# EAGLE schematic PCB_Design (EAGLE 8.6.0)
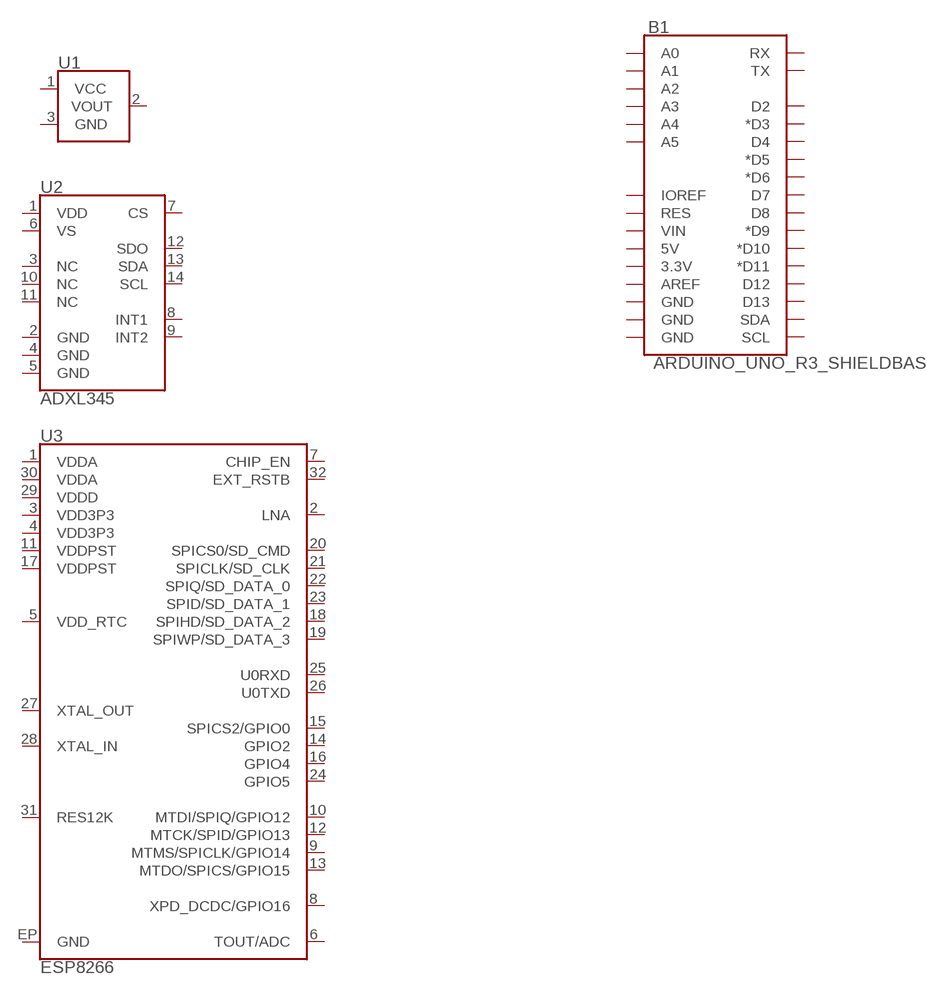
[diagram p0: schematic, sheet 1]

## Parts
B1  ARDUINO_UNO_R3_SHIELDBASIC  [UNO_R3_SHIELD]
U1  TMP36GT9  [TO-92]
U2  ADXL345  [LGA-14]
U3  ESP8266  [QFN32-5X5MM]
Unconnected: B1.3.3V B1.5V B1.A0 B1.A1 B1.A2 B1.A3 B1.A4 B1.A5 B1.AREF B1.D2 B1.D3(*D3) B1.D4 B1.D5(*D5) B1.D6(*D6) B1.D7 B1.D8 B1.D9(*D9) B1.D10(*D10) B1.D11(*D11) B1.D12 B1.D13 B1.GND@0(GND) B1.GND@1(GND) B1.GND@2(GND) B1.IOREF B1.RES B1.RX B1.SCL B1.SDA B1.TX B1.VIN U1.1(VCC) U1.2(VOUT) U1.3(GND) U2.1(VDD) U2.2(GND) U2.3(NC) U2.4(GND) U2.5(GND) U2.6(VS) U2.7(CS) U2.8(INT1) U2.9(INT2) U2.10(NC) U2.11(NC) U2.12(SDO) U2.13(SDA) U2.14(SCL) U3.1(VDDA) U3.2(LNA) U3.3(VDD3P3) U3.4(VDD3P3) U3.5(VDD_RTC) U3.6(TOUT/ADC) U3.7(CHIP_EN) U3.8(XPD_DCDC/GPIO16) U3.9(MTMS/SPICLK/GPIO14) U3.10(MTDI/SPIQ/GPIO12) U3.11(VDDPST) U3.12(MTCK/SPID/GPIO13) U3.13(MTDO/SPICS/GPIO15) U3.14(GPIO2) U3.15(SPICS2/GPIO0) U3.16(GPIO4) U3.17(VDDPST) U3.18(SPIHD/SD_DATA_2) U3.19(SPIWP/SD_DATA_3) U3.20(SPICS0/SD_CMD) U3.21(SPICLK/SD_CLK) U3.22(SPIQ/SD_DATA_0) U3.23(SPID/SD_DATA_1) U3.24(GPIO5) U3.25(U0RXD) U3.26(U0TXD) U3.27(XTAL_OUT) U3.28(XTAL_IN) U3.29(VDDD) U3.30(VDDA) U3.31(RES12K) U3.32(EXT_RSTB) U3.EP(GND)

## Library data of the parts
B1 = SparkFun-Boards:ARDUINO_UNO_R3_SHIELD: Arduino R3 Shield Footprint Shield form compatible with the Arduino Uno R3. SparkFun Products: MG2639 Cellular Shield <https://www.sparkfun.com/products/13120> MIDI Shield <https://www.sparkfun.com/products/12898> R3 Stackable Headers Kit <https://www.sparkfun.com/products/11417>
U1 = SparkFun-Sensors:TMP36: TMP36 Precision Analog °C Temperature Sensor The TMP36 is a low voltage, precision centigrade temperature sensor. It provides a voltage output that is linearly proportional to the Celsius temperature. It also doesn’t require any external calibration to provide typical accuracies of ±1°C at +25°C and ±2°C over the −40°C to +125°C temperature range. We like it because it’s so easy to use: Just give the device a ground and 2.7 to 5.5 VDC and read the voltage on the Vout pin. The output voltage can be converted to temperature easily using the scale factor of 10 mV/°C. Datasheet <http://cdn.sparkfun.com/datasheets/Sensors/Temp/TMP35_36_37.pdf> SparkFun Products Temperature Sensor - TMP36 <https://www.sparkfun.com/products/10988> (SEN-10988) SparkFun Danger Shield <https://www.sparkfun.com/products/11649> (DEV-11649); PROD_ID: IC-09880; SF_ID: SEN-10988
U2 = SparkFun-Sensors:ADXL345: Analog Devices ADXL345 3-Axis SPI/I2C 2/4/8/16g Accelerometer The ADXL345 is a small, thin, low power, 3-axis accelerometer with high resolution (13-bit) measurement at up to ±16g. Digital output data is formatted as 16-bit twos complement and is accessible through either a SPI (3- or 4-wire) or I2C digital interface. Datasheet <https://www.sparkfun.com/datasheets/Sensors/Accelerometer/ADXL345.pdf> SparkFun Products SparkFun Triple Axis Accelerometer Breakout - ADXL345 <https://www.sparkfun.com/products/9836> (SEN-09836) Triple Axis Accelerometer - ADXL345 <https://www.sparkfun.com/products/9045> (SEN-09045) SparkFun 6 Degrees of Freedom IMU Digital Combo Board - ITG3200/ADXL345 <https://www.sparkfun.com/products/10121> (SEN-10121); PROD_ID: IC-09097; SF_ID: SEN-09045
U3 = SparkFun-RF:ESP8266: Espressif ESP8266 WiFi/Microcontroller SoC The ESP8266 WiFi Module is a self contained SOC with integrated TCP/IP protocol stack that can give any microcontroller access to your WiFi network. The ESP8266 is capable of either hosting an application or offloading all Wi-Fi networking functions from another application processor. SparkFun Products WiFi Module ESP8266 <https://www.sparkfun.com/products/13678> (WRL-13678) SparkFun ESP8266 Thing <https://www.sparkfun.com/products/13231> (WRL-13231) SparkFun WiFi Shield - ESP8266 <https://www.sparkfun.com/products/13287> (WRL-13287) SparkFun ESP8266 Thing - Dev Board <https://www.sparkfun.com/products/13711> (WRL-13711) SparkFun Blynk Board - ESP8266 <https://www.sparkfun.com/products/13794> (WRL-13794); PROD_ID: IC-12452